# EAGLE schematic Project Nixie (EAGLE 7.6.0)
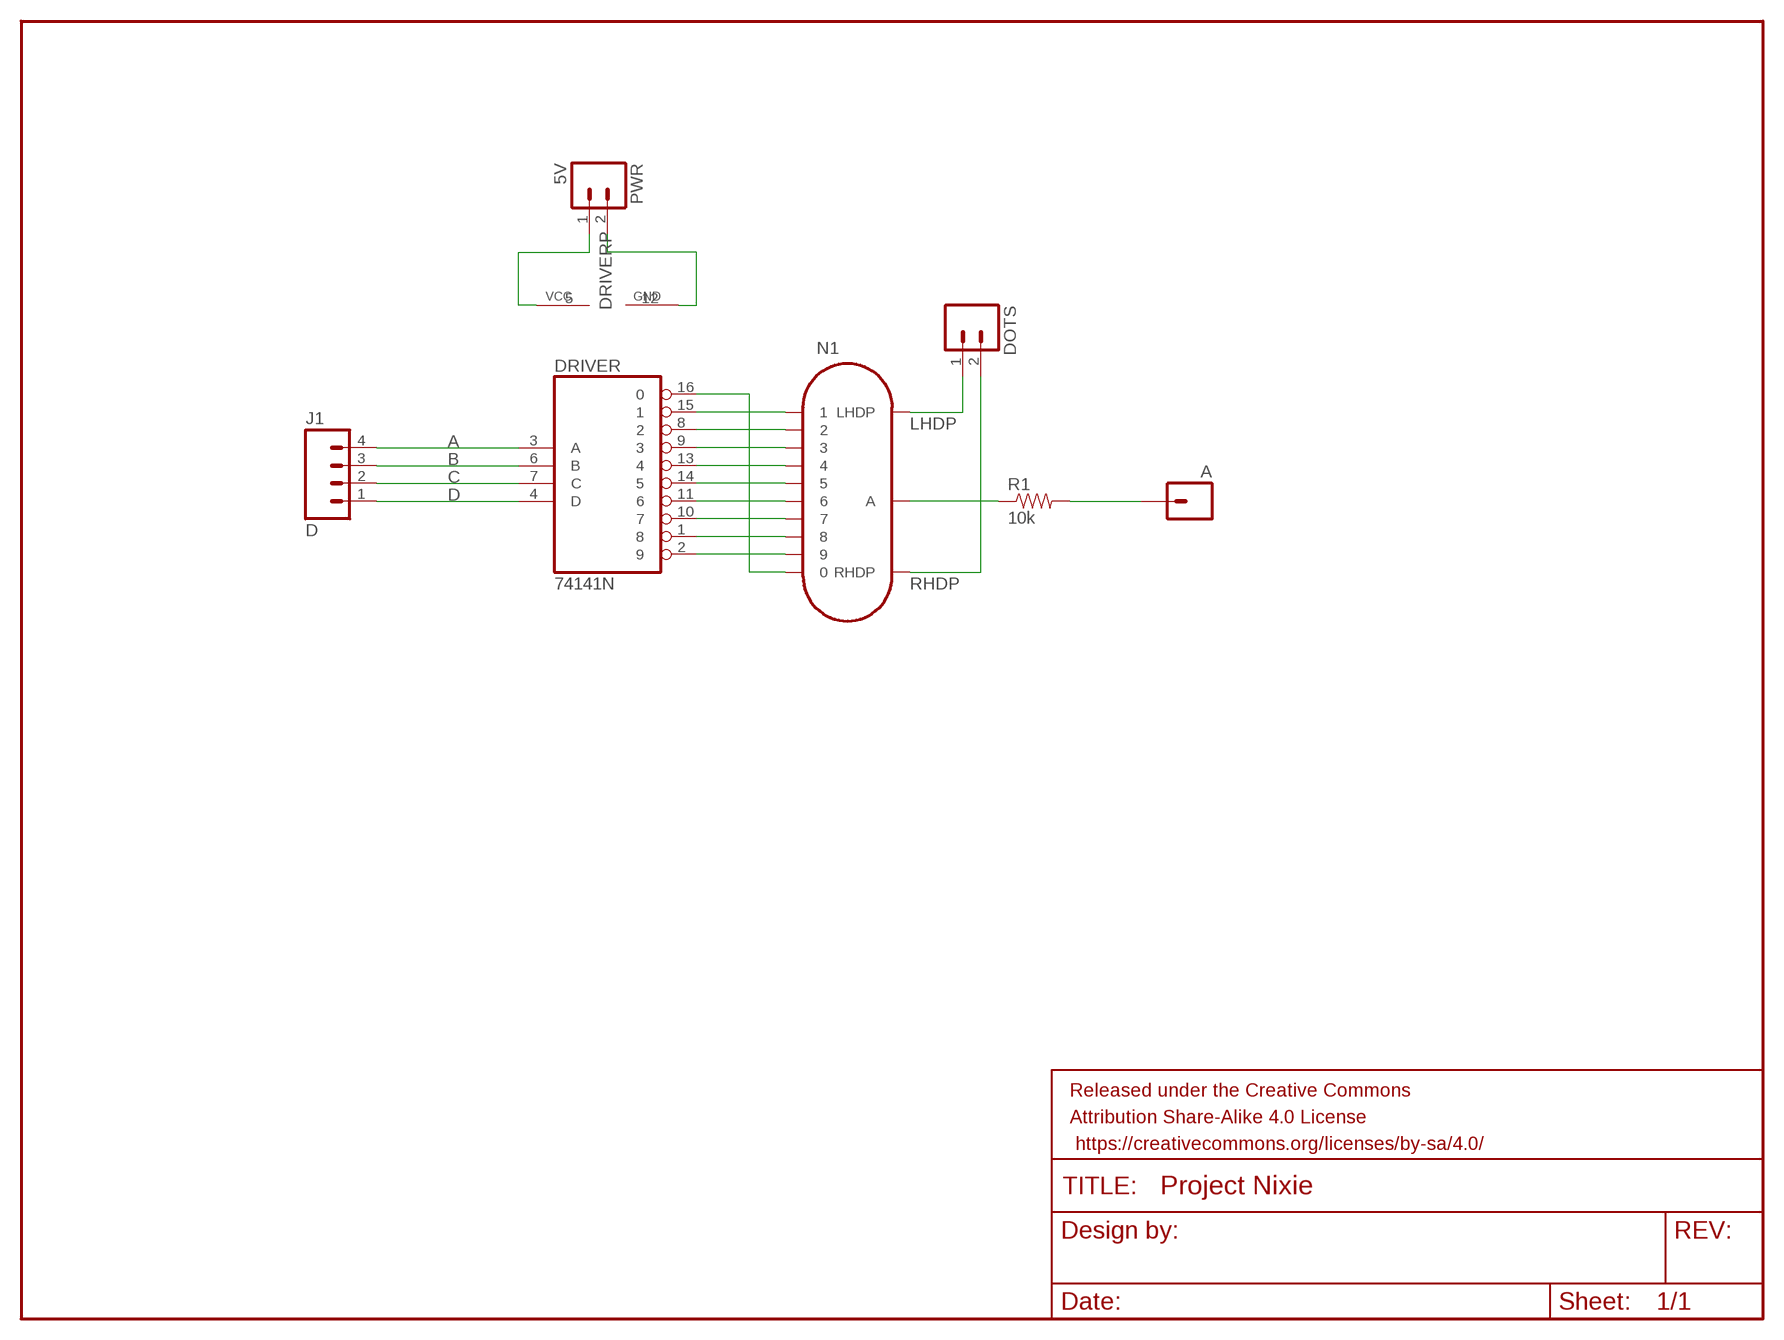
[diagram p0: schematic, sheet 1]

## Parts
A  M01PTH  [1X01]
DOTS  M02PTH  [1X02]
DRIVER  74141N  [DIL16]
FRAME1  FRAME-LETTER  [CREATIVE_COMMONS]
J1  D  M04LOCK  [1X04_LOCK]
N1  IN-16  [IN-16]
PWR  5V  M02LOCK  [1X02_LOCK]
R1  10k  RESISTORAXIAL-0.3  [AXIAL-0.3]

## Nets
5V: DRIVER.5(VCC) PWR.1
A: DRIVER.3(A) J1.4
B: DRIVER.6(B) J1.3
C: DRIVER.7(C) J1.2
D: DRIVER.4(D) J1.1
GND: DRIVER.12(GND) PWR.2
LHDP: DOTS.1 N1.LHDP
N$1: DRIVER.2 N1.9
N$2: DRIVER.1 N1.8
N$3: DRIVER.10 N1.7
N$4: DRIVER.11 N1.6
N$5: DRIVER.14 N1.5
N$6: DRIVER.13 N1.4
N$7: DRIVER.9 N1.3
N$8: DRIVER.8 N1.2
N$9: DRIVER.15 N1.1
N$10: DRIVER.16 N1.0
N$11: N1.A R1.P$1
N$12: A.1 R1.P$2
RHDP: DOTS.2 N1.RHDP

## Library data of the parts
A = SparkFun-Connectors:M01: Header 1 Standard 1-pin 0.1" header. Use with straight break away headers (SKU : PRT-00116), right angle break away headers (PRT-00553), swiss pins (PRT-00743), machine pins (PRT-00117), and female headers (PRT-00115). SMTSO-256-ET is a "flush mount" nut for a 4-40 screw. The older package used to be too tight, and did not allow it to sit properly thru the drill hit. The latest (0.165DIA) fits nice and snug.
DOTS PWR = SparkFun-Connectors:M02: Standard 2-pin 0.1" header. Use with - straight break away headers ( PRT-00116) - right angle break away headers (PRT-00553) - swiss pins (PRT-00743) - machine pins (PRT-00117) - female headers (PRT-00115) Molex polarized connector foot print use with: PRT-08233 with associated crimp pins and housings. 2.54_SCREWTERM for use with PRT-10571. 3.5mm Screw Terminal footprints for PRT-08084 5mm Screw Terminal footprints for use with PRT-08432
DRIVER = 74xx-us:74*141: BCD to decimal DECODER/DRIVER
FRAME1 = SparkFun-Aesthetics:FRAME-LETTER: Schematic Frame Standard 8.5x11 US Letter frame
J1 = SparkFun-Connectors:M04: Header 4 Standard 4-pin 0.1" header. Use with straight break away headers (SKU : PRT-00116), right angle break away headers (PRT-00553), swiss pins (PRT-00743), machine pins (PRT-00117), and female headers (PRT-00115). Molex polarized connector foot print use with SKU : PRT-08231 with associated crimp pins and housings. 1MM SMD Version SKU: PRT-10208; PROD_ID: CONN-09696
N1 = russian-nixies:IN-16: IN-16: small numeric frontview nixie tube
R1 = SparkFun-Passives:RESISTOR: Resistor Basic schematic elements and footprints for 0603, 1206, and PTH resistors.